# Altium schematic sheet Microcontroller.SchDoc
size A4
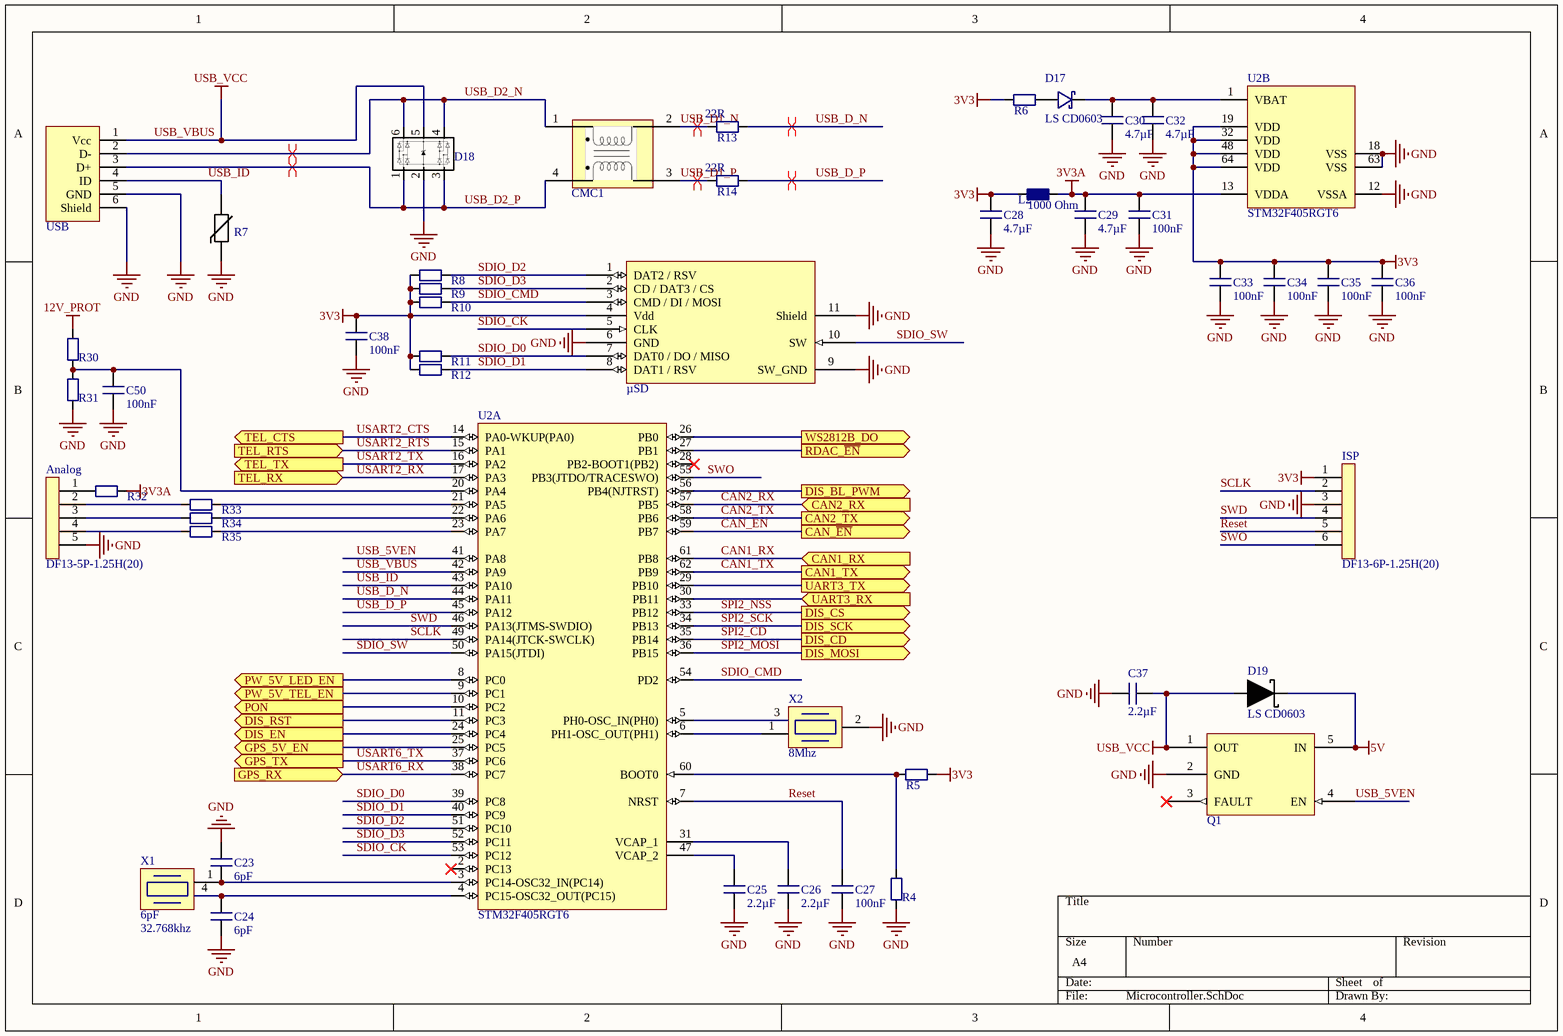
[diagram p0: Microcontroller.SchDoc]

## Parts
Analog  DF13-5P-1.25H(20)  [DF13-5P-1.25H(20)]
C23  6pF  [C0603H08_L]
C24  6pF  [C0603H08_L]
C25  2.2µF  [C0603H08_M]
C26  2.2µF  [C0603H08_M]
C27  100nF  [C0603H08_M]
C28  4.7µF  [C0603H08_L]
C29  4.7µF  [C0603H08_L]
C30  4.7µF  [C0603H08_L]
C31  100nF  [C0603H08_M]
C32  4.7µF  [C0603H08_L]
C33  100nF  [C0603H08_M]
C34  100nF  [C0603H08_M]
C35  100nF  [C0603H08_M]
C36  100nF  [C0603H08_M]
C37  2.2µF  [C0603H08_M]
C38  100nF  [C0603H08_M]
C50  100nF  [C0603H08_M]
CMC1  WURTH ELEKTRONIK - 744232090 - SIGNALFILTER, SMD, 90OHM, 370MA  [Murata 1206 CMC]  (value not drawn)
D17  LS CD0603  [CD 0603]
D18  WURTH ELEKTRONIK - 824015 - DIODENARRAY, TVS  [SOT95P255X116-6N]  (value not drawn)
D19  LS CD0603  [CD 0603]
ISP  DF13-6P-1.25H(20)  [DF13-6P-1.25H(20)]
L2  Value @ 100Mhz: 1000 Ohm  [R0603H05_L]  (hidden comment: 742792515)
Q1  Enhanced single channel power switches  [SOT-23-5]  (value not drawn)
R4  .Resistor  [R0603H05_M]  (value not drawn)
R5  .Resistor  [R0603H05_M]  (value not drawn)
R6  .Resistor  [R0603H05_M]  (value not drawn)
R7  Varistor 0805 4V WE 82550040  [Varistor 0805]  (value not drawn)
R8  .Resistor  [R0603H05_M]  (value not drawn)
R9  .Resistor  [R0603H05_M]  (value not drawn)
R10  .Resistor  [R0603H05_M]  (value not drawn)
R11  .Resistor  [R0603H05_M]  (value not drawn)
R12  .Resistor  [R0603H05_M]  (value not drawn)
R13  22R  [R0402H04_M]
R14  22R  [R0402H04_M]
R30  .Resistor  [R0603H05_M]  (value not drawn)
R31  .Resistor  [R0603H05_M]  (value not drawn)
R32  .Resistor  [R0603H05_M]  (value not drawn)
R33  .Resistor  [R0603H05_M]  (value not drawn)
R34  .Resistor  [R0603H05_M]  (value not drawn)
R35  .Resistor  [R0603H05_M]  (value not drawn)
U2  STM32F405RGT6  [STM-LQFP64_N]  (parts A,B of 2)
USB  Molex Micro USB B  [Micro USB Molex]  (value not drawn)
X1  value 32.768khz  Load: 6pF  [Abracon ABS25 Series Crystal]  (hidden comment: ABRACON - ABS25-32.768KHZ-6-1-T - QUARZ, 32.768KHZ, 6PF, SMD)
X2  value 8Mhz  [CSTCE_G15]  (hidden comment: 8MHz, 33pF)
µSD  Micro SD Connector  [Micro SD Connector 502774]  (value not drawn)

## Ports
CAN1_RX (in), CAN1_TX (out), CAN2_RX (in), CAN2_TX (out), CAN_~{EN} (out), DIS_BL_PWM (out), DIS_CD (out), DIS_CS (out), DIS_EN (out), DIS_MOSI (out), DIS_RST (out), DIS_SCK (out), GPS_5V_EN (out), GPS_RX (in), GPS_TX (out), PON (out), PW_5V_LED_EN (out), PW_5V_TEL_EN (out), RDAC_~{EN} (out), TEL_CTS (out), TEL_RTS (in), TEL_RX (in), TEL_TX (out), UART3_RX (in), UART3_TX (out), WS2812B_DO (out)

## Nets
3V3: C28.1 C33.1 C34.1 C35.1 C36.1 C38.1 ISP.1 L2.1 R5.2 R6.1 R8.1 R9.1 R10.1 R11.1 R12.1 U2.19(VDD) U2.32(VDD) U2.48(VDD) U2.64(VDD) µSD.4(Vdd)
3V3A: C29.1 C31.1 L2.2 R32.2 U2.13(VDDA)
5V: D19.1(C) Q1.5(IN)
12V_PROT: R30.2
GND: Analog.5 C23.1 C24.2 C25.2 C26.2 C27.2 C28.2 C29.2 C30.2 C31.2 C32.2 C33.2 C34.2 C35.2 C36.2 C37.1 C38.2 C50.2 D18.2 ISP.3 Q1.2(GND) R4.1 R7.2 R31.1 U2.12(VSSA) U2.18(VSS) U2.63(VSS) USB.5(GND) USB.6(Shield) X2.2 µSD.6(GND) µSD.9(SW_GND) µSD.11(Shield)
USB_VBUS: C37.2 D18.5 D19.2(A) Q1.1(OUT) U2.42(PA9) USB.1(Vcc)  [also labelled USB_VCC]
CAN1_RX: U2.61(PB8) ; port CAN1_RX
CAN1_TX: U2.62(PB9) ; port CAN1_TX
CAN2_RX: U2.57(PB5) ; port CAN2_RX
CAN2_TX: U2.58(PB6) ; port CAN2_TX
CAN_EN: U2.59(PB7) ; port CAN_~{EN}
DIS_BL_PWM: U2.56(PB4(NJTRST)) ; port DIS_BL_PWM
DIS_EN: U2.24(PC4) ; port DIS_EN
DIS_RST: U2.11(PC3) ; port DIS_RST
GPS_5V_EN: U2.25(PC5) ; port GPS_5V_EN
PON: U2.10(PC2) ; port PON
PW_5V_LED_EN: U2.8(PC0) ; port PW_5V_LED_EN
PW_5V_TEL_EN: U2.9(PC1) ; port PW_5V_TEL_EN
RDAC_~{EN}: U2.27(PB1) ; port RDAC_~{EN}
Reset: C27.1 ISP.5 U2.7(NRST)
SCLK: ISP.2 U2.49(PA14(JTCK-SWCLK))
SDIO_CK: U2.53(PC12) µSD.5(CLK)
SDIO_CMD: R10.2 U2.54(PD2) µSD.3(CMD_/_DI_/_MOSI)
SDIO_D0: R11.2 U2.39(PC8) µSD.7(DAT0_/_DO_/_MISO)
SDIO_D1: R12.2 U2.40(PC9) µSD.8(DAT1_/_RSV)
SDIO_D2: R8.2 U2.51(PC10) µSD.1(DAT2_/_RSV)
SDIO_D3: R9.2 U2.52(PC11) µSD.2(CD_/_DAT3_/_CS)
SDIO_SW: U2.50(PA15(JTDI)) µSD.10(SW)
SPI2_CD: U2.35(PB14) ; port DIS_CD
SPI2_MOSI: U2.36(PB15) ; port DIS_MOSI
SPI2_NSS: U2.33(PB12) ; port DIS_CS
SPI2_SCK: U2.34(PB13) ; port DIS_SCK
SWD: ISP.4 U2.46(PA13(JTMS-SWDIO))
SWO: ISP.6 U2.55(PB3(JTDO/TRACESWO))
UART3_RX: U2.30(PB11) ; port UART3_RX
UART3_TX: U2.29(PB10) ; port UART3_TX
USART2_CTS: U2.14(PA0-WKUP(PA0)) ; port TEL_CTS
USART2_RTS: U2.15(PA1) ; port TEL_RTS
USART2_RX: U2.17(PA3) ; port TEL_RX
USART2_TX: U2.16(PA2) ; port TEL_TX
USART6_RX: U2.38(PC7) ; port GPS_RX
USART6_TX: U2.37(PC6) ; port GPS_TX
USB_5VEN: Q1.4(EN) U2.41(PA8)
USB_D1_N: CMC1.2 R13.1
USB_D1_P: CMC1.3 R14.1
USB_D2_N: CMC1.1 D18.4 D18.6 USB.2(D-)
USB_D2_P: CMC1.4 D18.1 D18.3 USB.3(D+)
USB_D_N: R13.2 U2.44(PA11)
USB_D_P: R14.2 U2.45(PA12)
USB_ID: R7.1 U2.43(PA10) USB.4(ID)
WS2812B_DO: U2.26(PB0) ; port WS2812B_DO
NetAnalog_1: Analog.1 R32.1
NetAnalog_2: Analog.2 R33.1
NetAnalog_3: Analog.3 R34.1
NetAnalog_4: Analog.4 R35.1
NetC23_2: C23.2 U2.3(PC14-OSC32_IN(PC14)) X1.1
NetC24_1: C24.1 U2.4(PC15-OSC32_OUT(PC15)) X1.4
NetC25_1: C25.1 U2.47(VCAP_2)
NetC26_1: C26.1 U2.31(VCAP_1)
NetC30_1: C30.1 C32.1 D17.2 U2.1(VBAT)
NetC50_1: C50.1 R30.1 R31.2 U2.20(PA4)
NetD17_1: D17.1 R6.2
NetR4_2: R4.2 R5.1 U2.60(BOOT0)
NetR33_2: R33.2 U2.21(PA5)
NetR34_2: R34.2 U2.22(PA6)
NetR35_2: R35.2 U2.23(PA7)
NetU2_5: U2.5(PH0-OSC_IN(PH0)) X2.3
NetU2_6: U2.6(PH1-OSC_OUT(PH1)) X2.1

Not connected (* = marked no-connect by the designer): Q1 3(FAULT)*; U2 2(PC13)* 28(PB2-BOOT1(PB2))*; X1 2 3

## Layout directives
differential pair: USB_D1_N, USB_D1_P, USB_D2_N, USB_D2_P, USB_D_N, USB_D_P

## Library data of the parts
Analog = Hirose DF13-5P-1.25H(20): Circuits: 5; Connector Orientation: Right Angle; Model: DF13-5P-1.25H(20); Mounting Style: SMT
C23 C24 = C 6pF 50V 0603 MLCC C0G/NP0: Form: 0603 [M 1608]; Temperature Coeffizient: 0ppm/°C +- 30ppm/°C; Tolerance: +-0.5pF; Farnell Order Number: 1759047; Price: 0.009; Series: C0G/NP0; Voltage Rating: 50V; Temperature Range: -55°C to +125°C; Value: 6pF
C25 C26 C37 = C 2.2µF 6.3V 0603 MLCC X7R: Form: 0603 [M 1608]; Tolerance: +-10%; Farnell Order Number: 1657930; Price: 0.131; Series: X7R; Voltage Rating: 6.3V; Temperature Range: -55°C to +125°C; Temperature Coeffizient: N/A; Farnell: http://de.farnell.com/avx/06036c225kat2a/kondensator-2-2-uf-6-3v-0603-x7r/dp/1657930; Value: 2.2µF
C27 C31 C33-C36 C38 C50 = C 100nF 100V 0603 MLCC X7R: Form: 0603 [M 1608]; Temperature Coeffizient: 0ppm/°C +- 30ppm/°C; Tolerance: +-10%; Price: 0.044; Series: X7R; Voltage Rating: 100V; Temperature Range: -55°C to +125°C; Value: 100nF
C28-C30 C32 = C 4.7µF 6.3V 0603 MLCC X5R: Form: 0603 [M 1608]; Tolerance: +-10%; Farnell Order Number: 2496930; Price: 0.045; Series: X5R; Voltage Rating: 6.3V; Temperature Range: -55°C to +85°C; Value: 4.7µF
CMC1 = USB CMC 1206 WE 744232090 Chip CommonMod Choke 1206: Farnell: http://de.farnell.com/wurth-elektronik/744232090/signalfilter-smd-90ohm-370ma/dp/1636474; Farnell Order Number: 1636474; Price: 0.969
D18 = USB TVS Dioden Array 824015: Farnell: http://de.farnell.com/wurth-elektronik/824015/diodenarray-tvs/dp/1748615; Price: 0.866; Farnell Order Number: 1748615
ISP = Hirose DF13-6P-1.25H(20): Circuits: 6; Connector Orientation: Right Angle; Model: DF13-6P-1.25H(20); Mounting Style: SMT
L2 = Ferrit Bead 0603 1000Ohm 300mA: DC: 0.55Ohm; Farnell: http://de.farnell.com/fair-rite/25060310270/ferrite-perle-1000ohm-0-1-0603/dp/1463451; Price: 0.018; Farnell Order Number: 1463451; DC Current: 300mA
Q1 = HSS STMPS2151 High Side Switch 500mA (2151)/1000mA (2161): Farnell: http://de.farnell.com/stmicroelectronics/stmps2161str/power-switch-1ch-1000ma-sot23-5/dp/1842615; Farnell Order Number: 1842615; Price: 0,651
R7 = Varistor 0805 4V WE 82550040: WURTH ELEKTRONIK - 82550040 - SMD VARISTOR POWER 0805 4VRMS; Farnell: http://de.farnell.com/wurth-elektronik/82550040/smd-varistor-power-0805-4vrms/dp/1636439?Ntt=1636439; Farnell Order Number: 1636439; Price: 0.598
R13 R14 = .Resistor: Value: 22R
U2 = STM32F405RGT6: ARM Cortex-M4 32-bit MCU+FPU, 210 DMIPS, 1024 kB Flash, 192 kB Internal RAM, 51 I/Os, 64-pin LQFP, -40 to 85 degC, Tray; Manufacturer: STMicroelectronics; D/A Converter: 2x12-bit; FLASH Size (Prog) (kB): 1024; I/Os (High Current): 51; Internal RAM Size (kB): 192; Operating Frequency(F) (Processor speed) (MHz): 168; Supply Voltage(Vcc) max (V): 3.6; Supply Voltage(Vcc) min (V): 1.8; DatasheetVersion: Rev. 4; PackageVersion: Rev. 4, 06/2013; PackageReference: LQFP64; PackageDescription: 64-Pin Low Profile Quad Flat Package, 10 x 10 mm Body, 0.5 mm Pitch; Supplier 1: Digi-Key; Supplier Part Number 1: 497-11767-ND; Supplier 2: Farnell; Supplier Part Number 2: 2064363; Supplier 3: Newark; Supplier Part Number 3: 73T2329; Supplier 4: Mouser; Supplier Part Number 4: 511-STM32F405RGT6; Core: ARM Cortex-M4; Packing: Tray; Mounting Technology: Surface Mount; PartNumber: STM32F405RGT6; ComponentLink1Description: Manufacturer URL; ComponentLink1URL: http://www.st.com/web/en/home.html; ComponentLink2Description: Datasheet; ComponentLink2URL: http://www.st.com/st-web-ui/static/active/en/resource/technical/document/datasheet/DM00037051.pdf; ComponentLink3Description: Package Specification; ComponentLink3URL: http://www.st.com/st-web-ui/static/active/en/resource/technical/document/datasheet/DM00037051.pdf
USB = Molex Micro USB B: MOLEX - 105017-0001 - MICRO USB B, BUCHSE, SMT, RWKL, 5POL; Farnell: http://de.farnell.com/molex/105017-0001/micro-usb-b-buchse-smt-rwkl-5pol/dp/2293836?Ntt=105017-0001; Price: 0.738; Farnell Order Number: 2293836
X1 = Quarz 32.768khz: Farnell: http://de.farnell.com/abracon/abs25-32-768khz-6-1-t/quarz-32-768khz-6pf-smd/dp/2101353; Farnell Order Number: 2101353; Price: 0.741
X2 = Ceramic Resonator 8Mhz: MURATA - CSTCE8M00G55Z-R0 - RESONATOR,SMD 8.0MHZ; Farnell: http://de.farnell.com/murata/cstce8m00g55z-r0/resonator-smd-8-0mhz/dp/1615352; Farnell Order Number: 1615352; Price: 0.338
µSD = Molex MicroSD 502774: MOLEX - 502774-0891 - BUCHSE, MICROSD, PUSH-PUSH, 1.8MM; Farnell: http://de.farnell.com/molex/502774-0891/buchse-microsd-push-push-1-8mm/dp/2064063; Farnell Order Number: 2064063; Price: 1.98